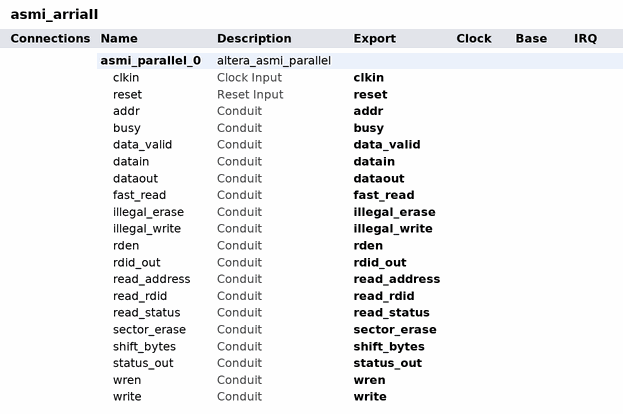
[diagram p0: system contents]
# Platform Designer (Qsys) system asmi_arriaII, Arria II GX EP2AGX125EF29C5
# Parameters at their usual value, and those the tool derives, are not listed.
package require -exact qsys 18.1
create_system asmi_arriaII
set_project_property DEVICE_FAMILY {Arria II GX}
set_project_property DEVICE EP2AGX125EF29C5

add_instance asmi_parallel_0 altera_asmi_parallel 18.1
set_instance_property asmi_parallel_0 AUTO_EXPORT true
set_instance_parameter_value asmi_parallel_0 CBX_AUTO_BLACKBOX ALL
set_instance_parameter_value asmi_parallel_0 DATA_WIDTH STANDARD
set_instance_parameter_value asmi_parallel_0 ENABLE_SIM false
set_instance_parameter_value asmi_parallel_0 EPCS_TYPE EPCS128
set_instance_parameter_value asmi_parallel_0 FLASH_RSTPIN FALSE
set_instance_parameter_value asmi_parallel_0 PAGE_SIZE 256
set_instance_parameter_value asmi_parallel_0 WRITE_DUMMY_CLK 0
set_instance_parameter_value asmi_parallel_0 gui_bulk_erase false
set_instance_parameter_value asmi_parallel_0 gui_die_erase false
set_instance_parameter_value asmi_parallel_0 gui_ex4b_addr false
set_instance_parameter_value asmi_parallel_0 gui_fast_read true
set_instance_parameter_value asmi_parallel_0 gui_page_write true
set_instance_parameter_value asmi_parallel_0 gui_read_address true
set_instance_parameter_value asmi_parallel_0 gui_read_dummyclk false
set_instance_parameter_value asmi_parallel_0 gui_read_rdid true
set_instance_parameter_value asmi_parallel_0 gui_read_sid false
set_instance_parameter_value asmi_parallel_0 gui_read_status true
set_instance_parameter_value asmi_parallel_0 gui_sector_erase true
set_instance_parameter_value asmi_parallel_0 gui_sector_protect false
set_instance_parameter_value asmi_parallel_0 gui_single_write false
set_instance_parameter_value asmi_parallel_0 gui_use_asmiblock false
set_instance_parameter_value asmi_parallel_0 gui_use_eab false
set_instance_parameter_value asmi_parallel_0 gui_wren true
set_instance_parameter_value asmi_parallel_0 gui_write true

# exported interfaces
add_interface addr conduit end
set_interface_property addr EXPORT_OF asmi_parallel_0.addr
add_interface busy conduit end
set_interface_property busy EXPORT_OF asmi_parallel_0.busy
add_interface clkin clock sink
set_interface_property clkin EXPORT_OF asmi_parallel_0.clkin
add_interface data_valid conduit end
set_interface_property data_valid EXPORT_OF asmi_parallel_0.data_valid
add_interface datain conduit end
set_interface_property datain EXPORT_OF asmi_parallel_0.datain
add_interface dataout conduit end
set_interface_property dataout EXPORT_OF asmi_parallel_0.dataout
add_interface fast_read conduit end
set_interface_property fast_read EXPORT_OF asmi_parallel_0.fast_read
add_interface illegal_erase conduit end
set_interface_property illegal_erase EXPORT_OF asmi_parallel_0.illegal_erase
add_interface illegal_write conduit end
set_interface_property illegal_write EXPORT_OF asmi_parallel_0.illegal_write
add_interface rden conduit end
set_interface_property rden EXPORT_OF asmi_parallel_0.rden
add_interface rdid_out conduit end
set_interface_property rdid_out EXPORT_OF asmi_parallel_0.rdid_out
add_interface read_address conduit end
set_interface_property read_address EXPORT_OF asmi_parallel_0.read_address
add_interface read_rdid conduit end
set_interface_property read_rdid EXPORT_OF asmi_parallel_0.read_rdid
add_interface read_status conduit end
set_interface_property read_status EXPORT_OF asmi_parallel_0.read_status
add_interface reset reset sink
set_interface_property reset EXPORT_OF asmi_parallel_0.reset
add_interface sector_erase conduit end
set_interface_property sector_erase EXPORT_OF asmi_parallel_0.sector_erase
add_interface shift_bytes conduit end
set_interface_property shift_bytes EXPORT_OF asmi_parallel_0.shift_bytes
add_interface status_out conduit end
set_interface_property status_out EXPORT_OF asmi_parallel_0.status_out
add_interface wren conduit end
set_interface_property wren EXPORT_OF asmi_parallel_0.wren
add_interface write conduit end
set_interface_property write EXPORT_OF asmi_parallel_0.write

set_interconnect_requirement {$system} qsys_mm.clockCrossingAdapter HANDSHAKE
set_interconnect_requirement {$system} qsys_mm.enableEccProtection FALSE
set_interconnect_requirement {$system} qsys_mm.insertDefaultSlave FALSE
set_interconnect_requirement {$system} qsys_mm.maxAdditionalLatency 1

save_system asmi_arriaII.qsys
